# Altium schematic sheet 02-Interface.SchDoc
size A4
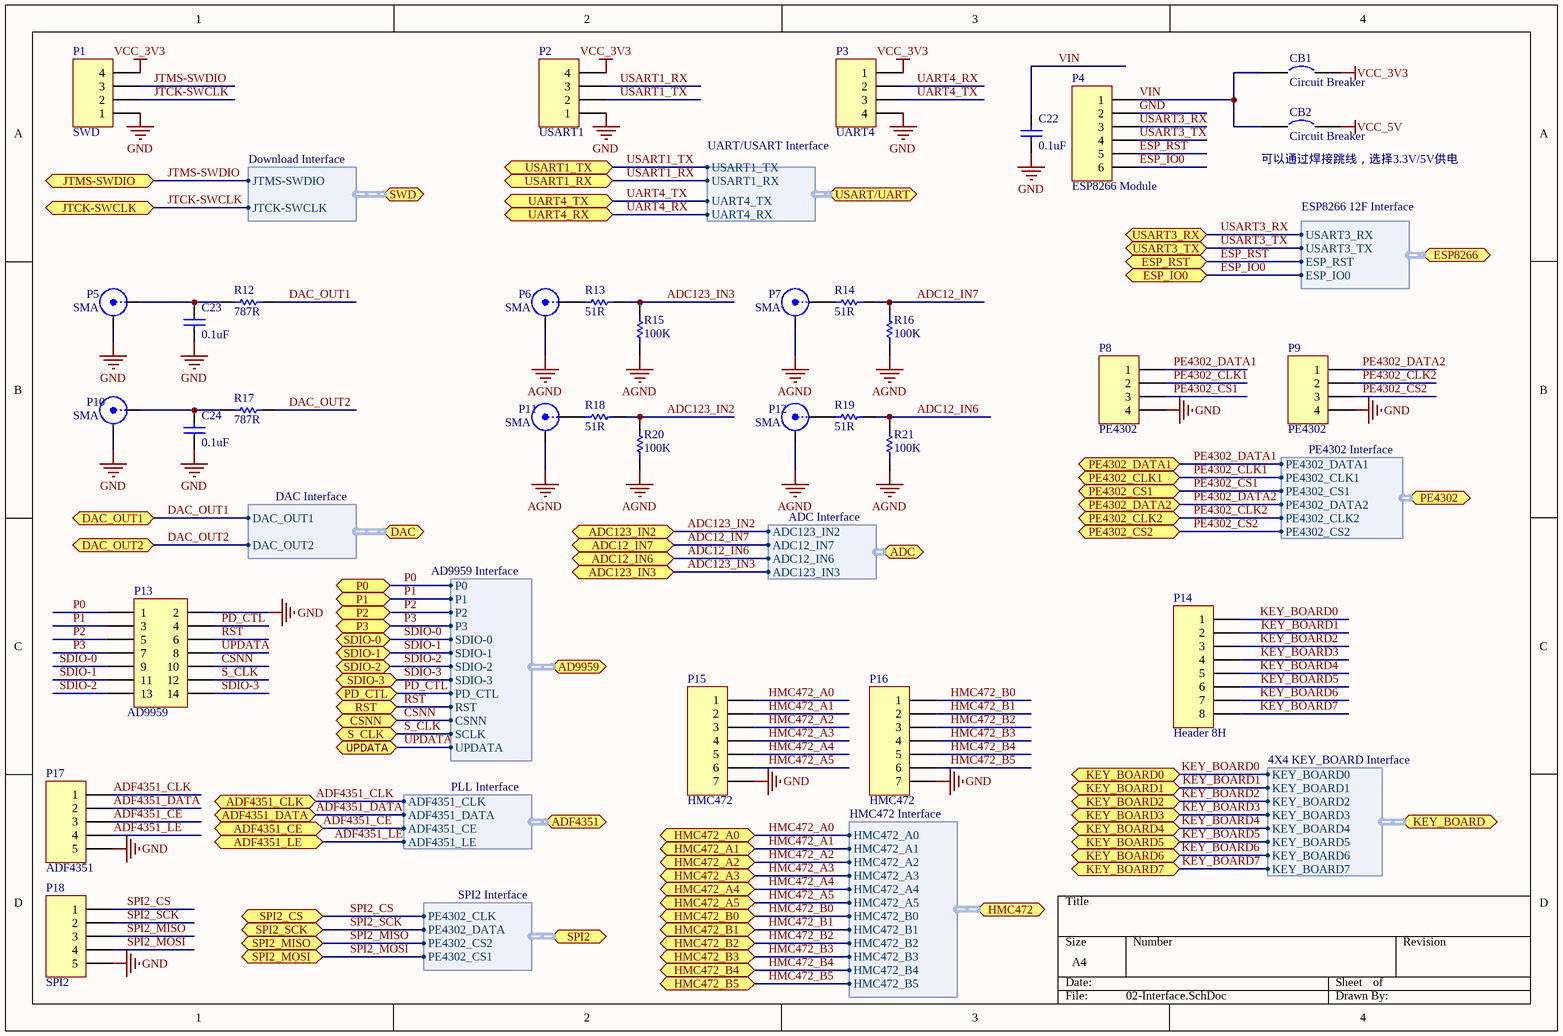
[diagram p0: 02-Interface.SchDoc]

## Parts
C22  0.1uF  [0603C]
C23  0.1uF  [0603C]
C24  0.1uF  [0603C]
CB1  Circuit Breaker  [CON20VP2R54-1X2TM]
CB2  Circuit Breaker  [CON20VP2R54-1X2TM]
P1  SWD  [1.25PWT-4P]
P2  USART1  [1.25PWT-4P]
P3  UART4  [XH_4]
P4  ESP8266 Module  [CON20VP2R54-1X6TM]
P5  SMA  [SMA-KE]
P6  SMA  [SMA-KE]
P7  SMA  [SMA-KE]
P8  PE4302  [XH_4]
P9  PE4302  [XH_4]
P10  SMA  [SMA-KE]
P11  SMA  [SMA-KE]
P12  SMA  [SMA-KE]
P13  AD9959  [CON20VP2R54-2X7TM-1]
P14  Header 8H  [XH_8]
P15  HMC472  [XH2.54-7P]
P16  HMC472  [XH2.54-7P]
P17  ADF4351  [XH_5]
P18  SPI2  [XH_5]
R12  787R  [0603R]
R13  51R  [0603R]
R14  51R  [0603R]
R15  100K  [0603R]
R16  100K  [0603R]
R17  787R  [0603R]
R18  51R  [0603R]
R19  51R  [0603R]
R20  100K  [0603R]
R21  100K  [0603R]

## Ports
AD9959 (bidir, harness AD9959 Interface), ADC12_IN6 (bidir), ADC12_IN7 (bidir), ADC123_IN2 (bidir), ADC123_IN3 (bidir), ADC (bidir, harness ADC Interface), ADF4351 (bidir, harness PLL Interface), ADF4351_CE (bidir), ADF4351_CLK (bidir), ADF4351_DATA (bidir), ADF4351_LE (bidir), CSNN (bidir), DAC (bidir, harness DAC Interface), DAC_OUT1 (bidir), DAC_OUT2 (bidir), ESP8266 (bidir, harness ESP8266 12F Interface), ESP_IO0 (bidir), ESP_RST (bidir), HMC472 (bidir, harness HMC472 Interface), HMC472_A0 (bidir), HMC472_A1 (bidir), HMC472_A2 (bidir), HMC472_A3 (bidir), HMC472_A4 (bidir), HMC472_A5 (bidir), HMC472_B0 (bidir), HMC472_B1 (bidir), HMC472_B2 (bidir), HMC472_B3 (bidir), HMC472_B4 (bidir), HMC472_B5 (bidir), JTCK-SWCLK (bidir), JTMS-SWDIO (bidir), KEY_BOARD0 (bidir), KEY_BOARD1 (bidir), KEY_BOARD2 (bidir), KEY_BOARD3 (bidir), KEY_BOARD4 (bidir), KEY_BOARD5 (bidir), KEY_BOARD6 (bidir), KEY_BOARD7 (bidir), KEY_BOARD (bidir, harness 4X4 KEY_BOARD Interface), P0 (bidir), P1 (bidir), P2 (bidir), P3 (bidir), PD_CTL (bidir), PE4302 (bidir, harness PE4302 Interface), PE4302_CLK1 (bidir), PE4302_CLK2 (bidir), PE4302_CS1 (bidir), PE4302_CS2 (bidir), PE4302_DATA1 (bidir), PE4302_DATA2 (bidir), RST (bidir), S_CLK (bidir), SDIO-0 (bidir), SDIO-1 (bidir), SDIO-2 (bidir), SDIO-3 (bidir), SPI2 (bidir, harness SPI2 Interface), SPI2_CS (bidir), SPI2_MISO (bidir), SPI2_MOSI (bidir), SPI2_SCK (bidir), SWD (bidir, harness Download Interface), UART4_RX (bidir), UART4_TX (bidir), UPDATA (bidir), USART1_RX (bidir), USART1_TX (bidir), USART3_RX (bidir), USART3_TX (bidir), USART/UART (bidir, harness UART/USART Interface)

## Harnesses
Download Interface: JTMS-SWDIO, JTCK-SWCLK
ESP8266 12F Interface: USART3_RX, USART3_TX, ESP_RST, ESP_IO0
UART/USART Interface: USART1_TX, USART1_RX, UART4_TX, UART4_RX
DAC Interface: DAC_OUT1, DAC_OUT2
SPI2 Interface: PE4302_CLK, PE4302_DATA, PE4302_CS2, PE4302_CS1
HMC472 Interface: HMC472_A0, HMC472_A1, HMC472_A2, HMC472_A3, HMC472_A4, HMC472_A5, HMC472_B0, HMC472_B1, HMC472_B2, HMC472_B3, HMC472_B4, HMC472_B5
4X4 KEY_BOARD Interface: KEY_BOARD0, KEY_BOARD1, KEY_BOARD2, KEY_BOARD3, KEY_BOARD4, KEY_BOARD5, KEY_BOARD6, KEY_BOARD7
ADC Interface: ADC123_IN2, ADC12_IN7, ADC12_IN6, ADC123_IN3
AD9959 Interface: P0, P1, P2, P3, SDIO-0, SDIO-1, SDIO-2, SDIO-3, PD_CTL, RST, CSNN, SCLK, UPDATA
PLL Interface: ADF4351_CLK, ADF4351_DATA, ADF4351_CE, ADF4351_LE
PE4302 Interface: PE4302_DATA1, PE4302_CLK1, PE4302_CS1, PE4302_DATA2, PE4302_CLK2, PE4302_CS2

## Nets
AGND: P6.2(Y) P7.2(Y) P11.2(Y) P12.2(Y) R15.2 R16.2 R20.2 R21.2
GND: C22.2 C23.2 C24.2 P1.1 P2.1 P3.4 P4.2 P5.2(Y) P8.4 P9.4 P10.2(Y) P13.2 P15.7 P16.7 P17.5 P18.5
VCC_3V3: CB1.2 P1.4 P2.4 P3.1
VCC_5V: CB2.2
ADC12_IN6: R19.1 R21.1 ; port ADC12_IN6, port ADC.ADC12_IN6
ADC12_IN7: R14.1 R16.1 ; port ADC12_IN7, port ADC.ADC12_IN7
ADC123_IN2: R18.1 R20.1 ; port ADC123_IN2, port ADC.ADC123_IN2
ADC123_IN3: R13.1 R15.1 ; port ADC123_IN3, port ADC.ADC123_IN3
ADF4351_CE: P17.3 ; port ADF4351_CE, port ADF4351.ADF4351_CE
ADF4351_CLK: P17.1 ; port ADF4351_CLK, port ADF4351.ADF4351_CLK
ADF4351_DATA: P17.2 ; port ADF4351_DATA, port ADF4351.ADF4351_DATA
ADF4351_LE: P17.4 ; port ADF4351_LE, port ADF4351.ADF4351_LE
CSNN: P13.10 ; port CSNN, port AD9959.CSNN
DAC_OUT1: R12.1 ; port DAC_OUT1, port DAC.DAC_OUT1
DAC_OUT2: R17.1 ; port DAC_OUT2, port DAC.DAC_OUT2
ESP_IO0: P4.6 ; port ESP_IO0, port ESP8266.ESP_IO0
ESP_RST: P4.5 ; port ESP_RST, port ESP8266.ESP_RST
HMC472_A0: P15.1 ; port HMC472_A0, port HMC472.HMC472_A0
HMC472_A1: P15.2 ; port HMC472_A1, port HMC472.HMC472_A1
HMC472_A2: P15.3 ; port HMC472_A2, port HMC472.HMC472_A2
HMC472_A3: P15.4 ; port HMC472_A3, port HMC472.HMC472_A3
HMC472_A4: P15.5 ; port HMC472_A4, port HMC472.HMC472_A4
HMC472_A5: P15.6 ; port HMC472_A5, port HMC472.HMC472_A5
HMC472_B0: P16.1 ; port HMC472_B0, port HMC472.HMC472_B0
HMC472_B1: P16.2 ; port HMC472_B1, port HMC472.HMC472_B1
HMC472_B2: P16.3 ; port HMC472_B2, port HMC472.HMC472_B2
HMC472_B3: P16.4 ; port HMC472_B3, port HMC472.HMC472_B3
HMC472_B4: P16.5 ; port HMC472_B4, port HMC472.HMC472_B4
HMC472_B5: P16.6 ; port HMC472_B5, port HMC472.HMC472_B5
JTCK-SWCLK: P1.2 ; port JTCK-SWCLK, port SWD.JTCK-SWCLK
JTMS-SWDIO: P1.3 ; port JTMS-SWDIO, port SWD.JTMS-SWDIO
KEY_BOARD0: P14.1 ; port KEY_BOARD0, port KEY_BOARD.KEY_BOARD0
KEY_BOARD1: P14.2 ; port KEY_BOARD1, port KEY_BOARD.KEY_BOARD1
KEY_BOARD2: P14.3 ; port KEY_BOARD2, port KEY_BOARD.KEY_BOARD2
KEY_BOARD3: P14.4 ; port KEY_BOARD3, port KEY_BOARD.KEY_BOARD3
KEY_BOARD4: P14.5 ; port KEY_BOARD4, port KEY_BOARD.KEY_BOARD4
KEY_BOARD5: P14.6 ; port KEY_BOARD5, port KEY_BOARD.KEY_BOARD5
KEY_BOARD6: P14.7 ; port KEY_BOARD6, port KEY_BOARD.KEY_BOARD6
KEY_BOARD7: P14.8 ; port KEY_BOARD7, port KEY_BOARD.KEY_BOARD7
P0: P13.1 ; port P0, port AD9959.P0
P1: P13.3 ; port P1, port AD9959.P1
P2: P13.5 ; port P2, port AD9959.P2
P3: P13.7 ; port P3, port AD9959.P3
PD_CTL: P13.4 ; port PD_CTL, port AD9959.PD_CTL
PE4302_CLK1: P8.2 ; port PE4302_CLK1, port PE4302.PE4302_CLK1
PE4302_CLK2: P9.2 ; port PE4302_CLK2, port PE4302.PE4302_CLK2
PE4302_CS1: P8.3 ; port PE4302_CS1, port PE4302.PE4302_CS1
PE4302_CS2: P9.3 ; port PE4302_CS2, port PE4302.PE4302_CS2
PE4302_DATA1: P8.1 ; port PE4302_DATA1, port PE4302.PE4302_DATA1
PE4302_DATA2: P9.1 ; port PE4302_DATA2, port PE4302.PE4302_DATA2
RST: P13.6 ; port RST, port AD9959.RST
S_CLK: P13.12 ; port S_CLK, port AD9959.SCLK
SDIO-0: P13.9 ; port SDIO-0, port AD9959.SDIO-0
SDIO-1: P13.11 ; port SDIO-1, port AD9959.SDIO-1
SDIO-2: P13.13 ; port SDIO-2, port AD9959.SDIO-2
SDIO-3: P13.14 ; port SDIO-3, port AD9959.SDIO-3
SPI2_CS: P18.1 ; port SPI2_CS, port SPI2.PE4302_CLK
SPI2_MISO: P18.3 ; port SPI2_MISO, port SPI2.PE4302_CS2
SPI2_MOSI: P18.4 ; port SPI2_MOSI, port SPI2.PE4302_CS1
SPI2_SCK: P18.2 ; port SPI2_SCK, port SPI2.PE4302_DATA
UART4_RX: P3.2 ; port UART4_RX, port USART/UART.UART4_RX
UART4_TX: P3.3 ; port UART4_TX, port USART/UART.UART4_TX
UPDATA: P13.8 ; port UPDATA, port AD9959.UPDATA
USART1_RX: P2.3 ; port USART1_RX, port USART/UART.USART1_RX
USART1_TX: P2.2 ; port USART1_TX, port USART/UART.USART1_TX
USART3_RX: P4.3 ; port USART3_RX, port ESP8266.USART3_RX
USART3_TX: P4.4 ; port USART3_TX, port ESP8266.USART3_TX
VIN: C22.1 CB1.1 CB2.1 P4.1
NetC23_1: C23.1 P5.1(X) R12.2
NetC24_1: C24.1 P10.1(X) R17.2
NetP6_1: P6.1(X) R13.2
NetP7_1: P7.1(X) R14.2
NetP11_1: P11.1(X) R18.2
NetP12_1: P12.1(X) R19.2

## Notes on the sheet
- (near CB2) 可以通过焊接跳线，选择3.3V/5V供电

## Library data of the parts
C22-C24 = Cap1: CAP CER 10000PF 100V X7R 0603; Manufacturer: TDK Corporation; Manufacturer Part Number: C1608X7R2A103K080AA; Tolerance: ±10%; Notification: Current market demand for these product types have resulted in fluctuating and extending lead times. Lead times may differ.; Supplier 1: Digi-Key; RoHS: RoHS Compliant; Category: Capacitors; Stock 1: 40000; Pricing 1: 4000=0.01438 (USD); Packaging: Tape & Reel (TR); Part Status: Active; Voltage - Rated: 100V; Temperature Coefficient: X7R; Operating Temperature: -55°C ~ 125°C; Features: -; Ratings: -; Applications: General Purpose; Failure Rate: -; Mounting Type: Surface Mount, MLCC; Package / Case: 0603 (1608 Metric); Size / Dimension: 0.063" L x 0.032" W (1.60mm x 0.80mm); Height - Seated (Max): -; Thickness (Max): 0.035" (0.90mm); Lead Spacing: -; Lead Style: -; ComponentLink1URL: https://product.tdk.com/info/en/catalog/datasheets/mlcc_commercial_midvoltage_en.pdf; ComponentLink1Description: https://product.tdk.com/info/en/catalog/datasheets/mlcc_commercial_midvoltage_en.pdf; Supplier Part Number 1: 445-1304-2-ND; Value: 0.1uF
P1-P3 P8 P9 = Header 4: Header, 4-Pin; LatestRevisionDate: 17-Jul-2002; LatestRevisionNote: Re-released for DXP Platform.; Publisher: Altium Limited
P4 = Header 6: Header, 6-Pin; LatestRevisionDate: 17-Jul-2002; LatestRevisionNote: Re-released for DXP Platform.; Publisher: Altium Limited
P5-P7 P10-P12 = BNC: BNC Elbow Connector; LatestRevisionDate: 17-Jul-2002; LatestRevisionNote: Re-released for DXP Platform.; Publisher: Altium Limited
P13 = Header 7X2: Header, 7-Pin, Dual row; LatestRevisionDate: 17-Jul-2002; LatestRevisionNote: Re-released for DXP Platform.; Publisher: Altium Limited
P14 = Header 8H: Header, 8-Pin, Right Angle; LatestRevisionDate: 17-Jul-2002; LatestRevisionNote: Re-released for DXP Platform.; Publisher: Altium Limited
P15 P16 = Header 7: Header, 7-Pin; LatestRevisionDate: 17-Jul-2002; LatestRevisionNote: Re-released for DXP Platform.; Publisher: Altium Limited
P17 P18 = Header 5: Header, 5-Pin; LatestRevisionDate: 17-Jul-2002; LatestRevisionNote: Re-released for DXP Platform.; Publisher: Altium Limited
R12-R21 = Res1: RES SMD 1K OHM 0.5% 1/16W 0603; Manufacturer: Susumu; Manufacturer Part Number: RR0816P-102-D; Power (Watts): 0.063W, 1/16W; Temperature Coefficient: ±25ppm/°C; Supplier 1: Digi-Key; RoHS: RoHS Compliant; Category: Resistors; Stock 1: 1648842; Pricing 1: 1=0.13, 10=0.122, 100=0.0483, 1000=0.0225, 2500=0.01973 (USD); Packaging: Digi-Reel?; Part Status: Active; Tolerance: ±0.5%; Composition: Thin Film; Features: -; Operating Temperature: -55°C ~ 125°C; Package / Case: 0603 (1608 Metric); Supplier Device Package: -; Size / Dimension: 0.063" L x 0.032" W (1.60mm x 0.80mm); Height - Seated (Max): 0.020" (0.50mm); Failure Rate: -; ComponentLink1URL: http://www.susumu.co.jp/common/pdf/n_catalog_partition05_en.pdf; ComponentLink1Description: http://www.susumu.co.jp/common/pdf/n_catalog_partition05_en.pdf; Supplier Part Number 1: RR08P1.0KDDKR-ND
  R12 R17: Value: 787R
  R13 R14 R18 R19: Value: 51R
  R15 R16 R20 R21: Value: 100K
CB1 CB2 = Circuit Breaker: Published: 24-Mar-1999; LatestRevisionDate: 17-Jul-2002; LatestRevisionNote: Re-released for DXP Platform.; PackageReference: SPST-2; Publisher: Altium Limited; PackageDescription: Switch; 2 Leads